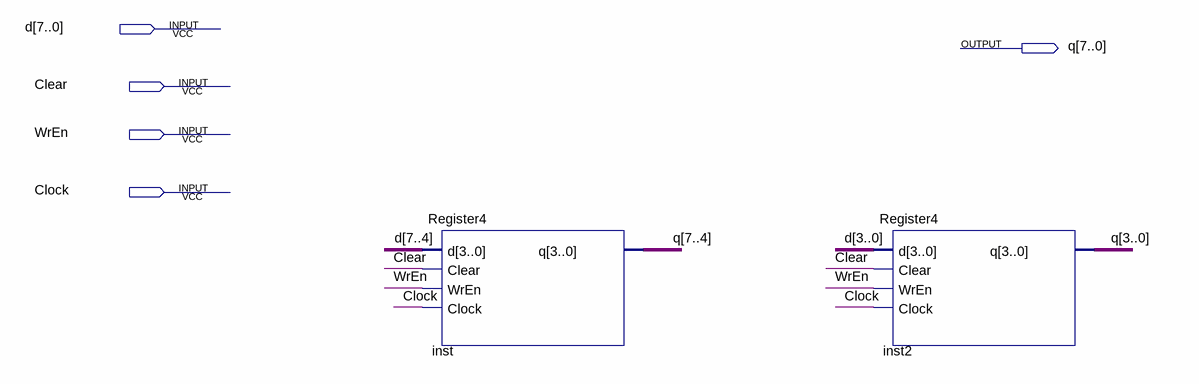
[diagram p0: schematic sheet]
// Quartus schematic Register8.bdf as structural Verilog: 2 symbols, 5 pins
module Register8 (
  input  [7:0] d,
  input  Clear,
  input  WrEn,
  input  Clock,
  output [7:0] q
);

  Register4 inst (.d(d[7:4]), .Clear(Clear), .WrEn(WrEn), .Clock(Clock), .q(q[7:4]));
  Register4 inst2 (.d(d[3:0]), .Clear(Clear), .WrEn(WrEn), .Clock(Clock), .q(q[3:0]));
endmodule
